# EAGLE design USB-C_Host_Shield (EAGLE 9.6.2)
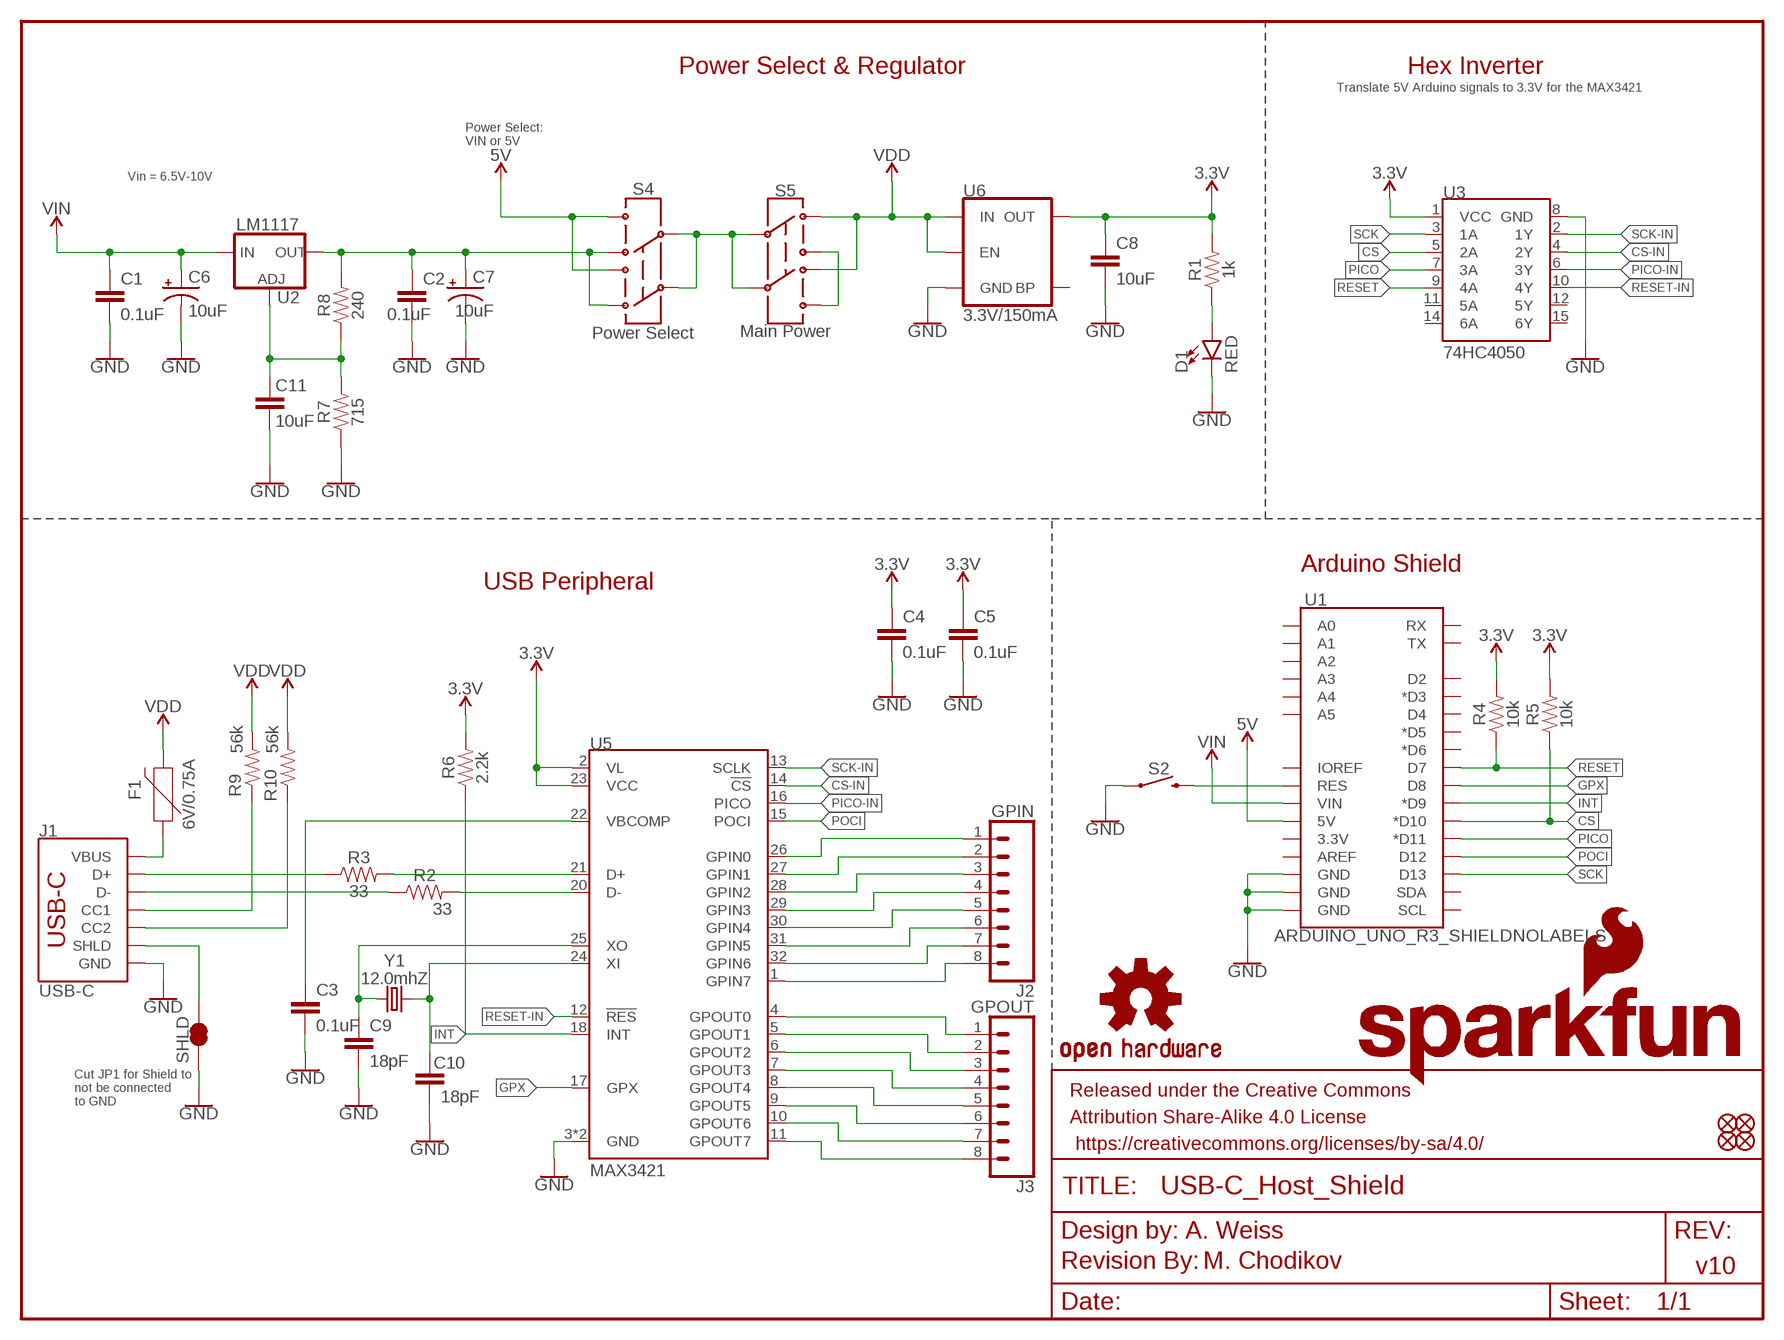
[diagram p0: schematic, sheet 1]

## Parts
C1  0.1uF  0.1UF-0603-25V-(+80/-20%)  [0603]
C2  0.1uF  0.1UF-0603-25V-(+80/-20%)  [0603]
C3  0.1uF  0.1UF-0603-25V-(+80/-20%)  [0603]
C4  0.1uF  0.1UF-0603-25V-(+80/-20%)  [0603]
C5  0.1uF  0.1UF-0603-25V-(+80/-20%)  [0603]
C6  10uF  10UF-POLAR-EIA3216-16V-10%(TANT)  [EIA3216]
C7  10uF  10UF-POLAR-EIA3216-16V-10%(TANT)  [EIA3216]
C8  10uF  10UF-0603-6.3V-20%  [0603]
C9  18pF  18PF-0603-50V-5%  [0603]
C10  18pF  18PF-0603-50V-5%  [0603]
C11  10uF  10UF-0805-25V-10%  [0805]
D1  RED  LED-RED0603  [LED-0603]
F1  6V/0.75A  PPTC_0.75A  [1206]
FD1  FIDUCIALUFIDUCIAL  [FIDUCIAL-MICRO]
FD2  FIDUCIALUFIDUCIAL  [FIDUCIAL-MICRO]
FD3  FIDUCIALUFIDUCIAL  [FIDUCIAL-MICRO]
FD4  FIDUCIALUFIDUCIAL  [FIDUCIAL-MICRO]
FRAME1  FRAME-LETTER  [CREATIVE_COMMONS]
J1  USB-C  USB_C_2-LAYER_PADS  [USB-C-16P-2LAYER-PADS]
J2  GPIN  CONN_08"  [1X08]
J3  GPOUT  CONN_08"  [1X08]
LOGO1  OSHW-LOGOM  [OSHW-LOGO-M]
LOGO2  SFE_LOGO_NAME_FLAME.1_INCH  [SFE_LOGO_NAME_FLAME_.1]
LOGO3  SFE_LOGO_NAME_FLAME.2_INCH  [SFE_LOGO_NAME_FLAME_.2]
LOGO7  REVISION  [REVISION]
R1  1k  1KOHM-0603-1/10W-1%  [0603]
R2  33  33OHM-0603-1/10W-1%  [0603]
R3  33  33OHM-0603-1/10W-1%  [0603]
R4  10k  10KOHM-0603-1/10W-1%  [0603]
R5  10k  10KOHM-0603-1/10W-1%  [0603]
R6  2.2k  2.2KOHM-0603-1/10W-1%  [0603]
R7  715  715OHM-0603-1/10W-1%  [0603]
R8  240  240OHM-0603-1/10W-1%  [0603]
R9  56k  56KOHM  [0603]
R10  56k  56KOHM  [0603]
S2  MOMENTARY-SWITCH-SPST-SMD-5.2MM-TALL  [TACTILE_SWITCH_SMD_5.2MM]
S4  Power Select  SWITCH-DPDT-SMD-AYZ0202  [SWITCH_DPDT_SMD_AYZ0202]
S5  Main Power  SWITCH-DPDT-SMD-AYZ0202  [SWITCH_DPDT_SMD_AYZ0202]
SHLD  JUMPER-SMT_2_NC_TRACE_SILK  [SMT-JUMPER_2_NC_TRACE_SILK]
U1  ARDUINO_UNO_R3_SHIELDNOLABELS  [UNO_R3_SHIELD_NOLABELS]
U2  LM1117  V_REG_LM1117SOT223  [SOT223]
U3  74HC4050  HEX_CONVERTER  [SO16]
U5  MAX3421  [TQFP32]
U6  3.3V/150mA  V_REG_MIC52053.3V  [SOT23-5]
Y1  12.0mhZ  CRYSTAL-12MHZ  [CRYSTAL-SMD-2X2.5MM]

## Nets
3.3V: C4.1 C5.1 C8.1 R1.2 R4.2 R5.2 R6.2 U3.1(VCC) U5.2(VL) U5.23(VCC) U6.5(OUT)
5V: S4.1 S4.4 U1.5V
CC1: J1.A5(CC1) R9.1
CC2: J1.B5(CC2) R10.1
CS: R5.1 U1.D10(*D10) U3.5(2A)
CS-IN: U3.4(2Y) U5.14(!CS)
D_N [diff pairs]: J1.A7(D-) J1.B7(D-) R2.1
D_P [diff pairs]: J1.A6(D+) J1.B6(D+) R3.1
GND: C1.2 C2.2 C3.2 C4.2 C5.2 C6.- C7.- C8.2 C9.2 C10.2 C11.2 D1.C J1.GND J1.GND2(GND) R7.1 S2.1 SHLD.1 U1.GND@0(GND) U1.GND@1(GND) U1.GND@2(GND) U3.8(GND) U5.3(GND) U5.19(GND) U6.2(GND)
GPIN0: J2.1 U5.26(GPIN0)
GPIN1: J2.2 U5.27(GPIN1)
GPIN2: J2.3 U5.28(GPIN2)
GPIN3: J2.4 U5.29(GPIN3)
GPIN4: J2.5 U5.30(GPIN4)
GPIN5: J2.6 U5.31(GPIN5)
GPIN6: J2.7 U5.32(GPIN6)
GPIN7: J2.8 U5.1(GPIN7)
GPOUT0: J3.1 U5.4(GPOUT0)
GPOUT1: J3.2 U5.5(GPOUT1)
GPOUT2: J3.3 U5.6(GPOUT2)
GPOUT3: J3.4 U5.7(GPOUT3)
GPOUT4: J3.5 U5.8(GPOUT4)
GPOUT5: J3.6 U5.9(GPOUT5)
GPOUT6: J3.7 U5.10(GPOUT6)
GPOUT7: J3.8 U5.11(GPOUT7)
GPX: U1.D8 U5.17(GPX)
INT: R6.1 U1.D9(*D9) U5.18(INT)
MAX_D_N: R2.2 U5.20(D-)
MAX_D_P: R3.2 U5.21(D+)
N$1: S2.3 U1.RES
N$2: S4.2 S4.5 S5.2 S5.5
N$4: C11.1 R7.2 R8.1 U2.1(ADJ)
N$5: S5.1 S5.4
N$6: C2.1 C7.+ R8.2 S4.3 S4.6 U2.2(OUT) U2.4(OUT)
N$7: D1.A R1.1
N$8: J1.SHLD1(SHLD) J1.SHLD2(SHLD) J1.SHLD3(SHLD) J1.SHLD4(SHLD) SHLD.2
PICO: U1.D11(*D11) U3.7(3A)
PICO-IN: U3.6(3Y) U5.16(PICO)
POCI: U1.D12 U5.15(POCI)
RESET: R4.1 U1.D7 U3.9(4A)
RESET-IN: U3.10(4Y) U5.12(!RES)
SCK: U1.D13 U3.3(1A)
SCK-IN: U3.2(1Y) U5.13(SCLK)
VBCOMP: C3.1 U5.22(VBCOMP)
VBUS: F1.1 J1.VBUS1(VBUS) J1.VBUS2(VBUS)
VDD: F1.2 R9.2 R10.2 S5.3 S5.6 U6.1(IN) U6.3(EN)
VIN: C1.1 C6.+ U1.VIN U2.3(IN)
XI: C10.1 U5.24(XI) Y1.P3
XO: C9.1 U5.25(XO) Y1.P1
Unconnected: U1.3.3V U1.A0 U1.A1 U1.A2 U1.A3 U1.A4 U1.A5 U1.AREF U1.D2 U1.D3(*D3) U1.D4 U1.D5(*D5) U1.D6(*D6) U1.IOREF U1.RX U1.SCL U1.SDA U1.TX U3.11(5A) U3.12(5Y) U3.14(6A) U3.15(6Y) U6.4(BP)

## Notes on the sheet
- Power Select & Regulator | Hex Inverter
- Translate 5V Arduino signals to 3.3V for the MAX3421
- Power Select:
  VIN or 5V
- Vin = 6.5V-10V
- Arduino Shield
- USB Peripheral
- Cut JP1 for Shield to
  not be connected
  to GND
- A. Weiss
- M. Chodikov | v10

## Library data of the parts
C1-C5 = SparkFun-Capacitors:0.1UF: 0.1µF ceramic capacitors A capacitor is a passive two-terminal electrical component used to store electrical energy temporarily in an electric field.; PROD_ID: CAP-00810
C6 C7 = SparkFun-Capacitors:10UF-POLAR: 10.0µF polarized capacitors A capacitor is a passive two-terminal electrical component used to store electrical energy temporarily in an electric field.; PROD_ID: CAP-00811
C8 = SparkFun-Capacitors:10UF: 10.0µF ceramic capacitors A capacitor is a passive two-terminal electrical component used to store electrical energy temporarily in an electric field.; PROD_ID: CAP-11015
C9 C10 = SparkFun-Capacitors:18PF: 18pF ceramic capacitors A capacitor is a passive two-terminal electrical component used to store electrical energy temporarily in an electric field.; PROD_ID: CAP-08267
C11 = SparkFun-Capacitors:10UF: 10.0µF ceramic capacitors A capacitor is a passive two-terminal electrical component used to store electrical energy temporarily in an electric field.; PROD_ID: CAP-14259
D1 = SparkFun-LED:LED-RED: Red SMD LED Used in manufacturing of most products at SparkFun Packages: 0603 - SMD 0603 package [Product Link] <http://docs.avagotech.com/docs/AV02-0551EN> 0603 SMART - SMD 0603 SMART package ( more efficient and expensive)[Product Link] <http://www.osram-os.com/Graphics/XPic2/00077099_0.pdf> 1206 - SMD1206 package [Product Link] <https://www.sparkfun.com/datasheets/DevTools/LilyPad/Q150OVS4.pdff> SparkFun Products: Pro Mini 328 -5V <https://www.sparkfun.com/products/821> RedBoard <https://www.sparkfun.com/products/12757> IOIO-OTG <https://www.sparkfun.com/products/13613>; PROD_ID: DIO-00819
F1 = SparkFun-Fuses:PPTC: Resettable Fuse PPTC Resettable Fuse. Really a sort of resistor with a polymeric positive temperature coefficient whose resistance increases dramatically with an increase in temperature. When heated by the power passing through the resistance rises causing the current to be limited, protecting the circuit. This is achieved by the transition of the polymer from a crystalline to an amorphous state where the conductive carbon separates breaking the conductive pathways found in the cool crystalline structure. When a PPTC cools back down it resumes conducting letting the circuit turn back on. SparkFun Products: SparkFun RedBoard - Programmed with Arduino <https://www.sparkfun.com/products/12757> Pro Micro - 5V/16MHz <https://www.sparkfun.com/products/12640> Arduino Pro 328 - 5V/16MHz <https://www.sparkfun.com/products/10915> MP3 Trigger <https://www.sparkfun.com/products/13720>; PROD_ID: RES-11150
FD1-FD4 = SparkFun-Aesthetics:FIDUCIAL: Fiducial Alignment Points Point-of-reference for pick-and-place machines and other optical instruments.
FRAME1 = SparkFun-Aesthetics:FRAME-LETTER: Schematic Frame - Letter Standard 8.5x11 US Letter frame
J1 = SparkFun-Connectors:USB_C: USB Type C 16Pin Connector Super Speed pins not available on the 16-pin purely SMD connector so this part is best for USB 2.0 implementations. D1 and D2 are tied together enabling D+/- no matter which way the cable is plugged into the connector. The two channel configuration pins (CC1/2) are exposed. These are normally connected to ground via 5.1k resistors but can be reconfigured for high current/high power applications. **4-LAYER BOARD WARNING!!** If designing 4-layer board, make sure to select the variant _4-LAYER-ISOLATED. The linked footprint (USB-C-16-4LAYER-ISOLATED) includes some very necessary cutout polygons in the inner layers (2 and 15). This prevents the PTH mounting shield legs on the USB connector from electrically connecting any other polygons on the inner layers (usually VCC and GND).; PROD_ID: CONN-14122
J2 J3 = SparkFun-Connectors:CONN_08: Multi connection point. Often used as Generic Header-pin footprint for 0.1 inch spaced/style header connections On any of the 0.1 inch spaced packages, you can populate with these: Break Away Headers - Straight <https://www.sparkfun.com/products/116> (PRT-00116) Break Away Male Headers - Right Angle <https://www.sparkfun.com/products/553> (PRT-00553) Female Headers <https://www.sparkfun.com/products/115> (PRT-00115) Break Away Headers - Machine Pin <https://www.sparkfun.com/products/117> (PRT-00117) Break Away Female Headers - Swiss Machine Pin <https://www.sparkfun.com/products/743> (PRT-00743) Arduino Stackable Header - 8 Pin <https://www.sparkfun.com/products/9279> (PRT-09279) For SCREWTERMINALS and SPRING TERMINALS visit here: Screw Terimnals on SparkFun.com <https://www.sparkfun.com/search/results?term=Screw+Terminals> (5mm/3.5mm/2.54mm spacing) This device is also useful as a general connection point to wire up your design to another part of your project. Our various solder wires solder well into these plated through hole pads. Hook-Up Wire - Assortment (Stranded, 22 AWG) <https://www.sparkfun.com/products/11375> (PRT-11375) Hook-Up Wire - Assortment (Solid Core, 22 AWG) <https://www.sparkfun.com/products/11367> (PRT-11367) View the entire wire category on our website here <https://www.sparkfun.com/categories/141> Special notes: Molex polarized connector foot print use with SKU : PRT-08231 with associated crimp pins and housings. 1MM SMD Version SKU: PRT-10208 NOTES ON THE VARIANTS LOCK and LOCK_LONGPADS... This footprint was designed to help hold the alignment of a through-hole component (i.e. 6-pin header) while soldering it into place. You may notice that each hole has been shifted either up or down by 0.005 of an inch from it's more standard position (which is a perfectly straight line). This slight alteration caused the pins (the squares in the middle) to touch the edges of the holes. Because they are alternating, it causes a "brace" to hold the component in place. 0.005 has proven to be the perfect amount of "off-center" position when using our standard breakaway headers. Although looks a little odd when you look at the bare footprint, once you have a header in there, the alteration is very hard to notice. Also,if you push a header all the way into place, it is covered up entirely on the bottom side.; PROD_ID: CONN-08438
LOGO1 = SparkFun-Aesthetics:OSHW-LOGO: Open-Source Hardware (OSHW) Logo This logo indicates the piece of hardware it is found on incorporates a OSHW license and/or adheres to the definition of open source hardware found here: http://freedomdefined.org/OSHW
LOGO2 LOGO3 = SparkFun-Aesthetics:SFE_LOGO_NAME_FLAME: SparkFun Font Logo w/ Flame This is the SparkFun full logo. The logo on the schematic will always be the same size; the package variant is the height of the flame part of the logo. Default layer for the logo on the board is tSilk.
LOGO7 = SparkFun-Aesthetics:REVISION: "Revision By" Text Preceding text for revisor documentation. Includes schematic text on "symbols" layer, and board text on tDoc.
R1 = SparkFun-Resistors:1KOHM: 1kΩ resistor A resistor is a passive two-terminal electrical component that implements electrical resistance as a circuit element. Resistors act to reduce current flow, and, at the same time, act to lower voltage levels within circuits. - Wikipedia; PROD_ID: RES-07856
R2 R3 = SparkFun-Resistors:33OHM: 33Ω resistor A resistor is a passive two-terminal electrical component that implements electrical resistance as a circuit element. Resistors act to reduce current flow, and, at the same time, act to lower voltage levels within circuits. - Wikipedia; PROD_ID: RES-08270
R4 R5 = SparkFun-Resistors:10KOHM: 10kΩ resistor A resistor is a passive two-terminal electrical component that implements electrical resistance as a circuit element. Resistors act to reduce current flow, and, at the same time, act to lower voltage levels within circuits. - Wikipedia; PROD_ID: RES-00824
R6 = SparkFun-Resistors:2.2KOHM: 2.2kΩ resistor A resistor is a passive two-terminal electrical component that implements electrical resistance as a circuit element. Resistors act to reduce current flow, and, at the same time, act to lower voltage levels within circuits. - Wikipedia; PROD_ID: RES-08272
R7 = SparkFun-Resistors:715OHM: 715Ω resistor A resistor is a passive two-terminal electrical component that implements electrical resistance as a circuit element. Resistors act to reduce current flow, and, at the same time, act to lower voltage levels within circuits. - Wikipedia; PROD_ID: RES-07850
R8 = SparkFun-Resistors:240OHM: 240Ω resistor A resistor is a passive two-terminal electrical component that implements electrical resistance as a circuit element. Resistors act to reduce current flow, and, at the same time, act to lower voltage levels within circuits. - Wikipedia; PROD_ID: RES-07849
R9 R10 = SparkFun-Resistors:56KOHM: 56kΩ Resistor; PROD_ID: RES-17211
S2 = SparkFun-Switches:MOMENTARY-SWITCH-SPST: Momentary Switch (Pushbutton) - SPST Normally-open (NO) SPST momentary switches (buttons, pushbuttons). Variants PTH-12MM - 12mm square, through-hole Momentary Pushbutton Switch - 12mm Square <https://www.sparkfun.com/products/9190> (COM-09190) PTH-6.0MM, PTH-6.0MM-KIT - 6.0mm square, through-hole Mini Pushbutton Switch <https://www.sparkfun.com/products/97> (COM-00097) KIT package intended for soldering kit's - only one side of pads' copper is exposed. PTH-RIGHT-ANGLE-KIT - Right-angle, through-hole Right Angle Tactile Button <https://www.sparkfun.com/products/10791> - Used on SparkFun BigTime Watch Kit <https://www.sparkfun.com/products/11734> SMD-12MM - 12mm square, surface-mount Tactile Button - SMD (12mm) <https://www.sparkfun.com/products/12993> (COM-12993) Used on SparkFun PicoBoard <https://www.sparkfun.com/products/11888> SMD-4.5MM - 4.5mm Square Trackball Switch Used on SparkFun Blackberry Trackballer Breakout <https://www.sparkfun.com/products/13169> SMD-4.6MMX2.8MM - 4.60mm x 2.80mm, surface mount Used on SparkFun Pro Micro - RP2040 <https://www.sparkfun.com/products/17717> SMD-5.2MM, SMD-5.2-REDUNDANT - 5.2mm square, surface-mount Mini Pushbutton Switch - SMD <https://www.sparkfun.com/products/8720> (COM-08720) Used on Arduino Pro Mini <https://www.sparkfun.com/products/11114> REDUNDANT package connects both switch circuits together SMD-6.0X3.5MM - 6.0 x 3.5mm, surface mount Momentary Reset Switch SMD <https://www.sparkfun.com/products/8229> (COM-08229) SMD-6.2MM-TALL - 6.2mm square, surface mount Tactile Button - SMD (6mm) <https://www.sparkfun.com/products/12992> Used on SparkFun Digital Sandbox <https://www.sparkfun.com/products/12651> SMD-RIGHT-ANGLE - Right-angle, surface mount Used on SparkFun Block for Intel® Edison - Arduino <https://www.sparkfun.com/products/13036>; PROD_ID: SWCH-14139
S4 S5 = SparkFun-Switches:SWITCH-DPDT: Double-Pole, Double-Throw (DPDT) Switch Double-pole, double-throw switches. Variant Overview PTH-GPI-152-3013 Used on SparkFun Geiger Counter <https://www.sparkfun.com/products/11345> SMD-AY0202 Surface Mount DPDT Switch <https://www.sparkfun.com/products/597> (COM-00597) Used on e.g. LilyPad Arduino USB - ATmega32U4 Board <https://www.sparkfun.com/products/12049>; PROD_ID: SWCH-08179; SF_SKU: COM-00597
SHLD = SparkFun-Jumpers:JUMPER-SMT_2_NC_TRACE: Normally closed trace jumper This jumper has a trace between two pads so it's normally closed (NC). Use a razor knife to open the connection. For best results follow the IPC guidelines for cutting traces: Cutout at least 0.063 mm (0.005 in). Remove all loose material to clean up the cut area. Seal the cut with an approved epoxy. Reapply solder to reclose the connection.
U1 = SparkFun-Boards:ARDUINO_UNO_R3_SHIELD: Arduino R3 Shield Footprint Shield form compatible with the Arduino Uno R3. SparkFun Products: MG2639 Cellular Shield <https://www.sparkfun.com/products/13120> MIDI Shield <https://www.sparkfun.com/products/12898> R3 Stackable Headers Kit <https://www.sparkfun.com/products/11417>
U2 = SparkFun-IC-Power:V_REG_LM1117: Voltage Regulator LM1117 Standard adjustable voltage regulator but in SMD form. Spark Fun Electronics SKU : COM-00595; PROD_ID: VREG-08170
U3 = SparkFun-IC-Comms:HEX_CONVERTER: 74HC4050 Hex Buffer 74HC4050 Hex Buffer Level Shifter SMD SO016 SparkFun Products CAN-BUS Shield <https://www.sparkfun.com/products/13262> (DEV-13262) SparkFun MP3 Player Shield <https://www.sparkfun.com/products/12660> (DEV-12660) SparkFun microSD Shield <https://www.sparkfun.com/products/12761> (DEV-12761) SparkFun USB Host Shield <https://www.sparkfun.com/products/9947> (DEV-09947); PROD_ID: IC-09604
U5 = SparkFun-IC-Microcontroller:MAX3421: USB Peripheral/Host Controller with SPI Interface; PROD_ID: IC-09517
U6 = SparkFun-IC-Power:V_REG_MIC5205: V_REG MIC5205 Standard 3.3V, 5V, and Adjustable 150mA LDO voltage regulator in SOT-23 layout. Micrel part MIC5205. BP (by-pass) pin is used to lower output noise with 470pF cap, may be left open. On the adjustable version BP is used to set output.; PROD_ID: VREG-00822
Y1 = SparkFun-Clocks:CRYSTAL-12MHZ: 12.0MHz Crystal Frequency: 12.0MHz Frequency Tolerance: ±20ppm Load Capacitance: 18pF SparkFun Products: SparkFun Logomatic <https://www.sparkfun.com/products/12772> Pocket AVR Programmer <https://www.sparkfun.com/products/9825>; PROD_ID: XTAL-15540

## Net classes
2 diff pairs: width 0.089 mm

## Board
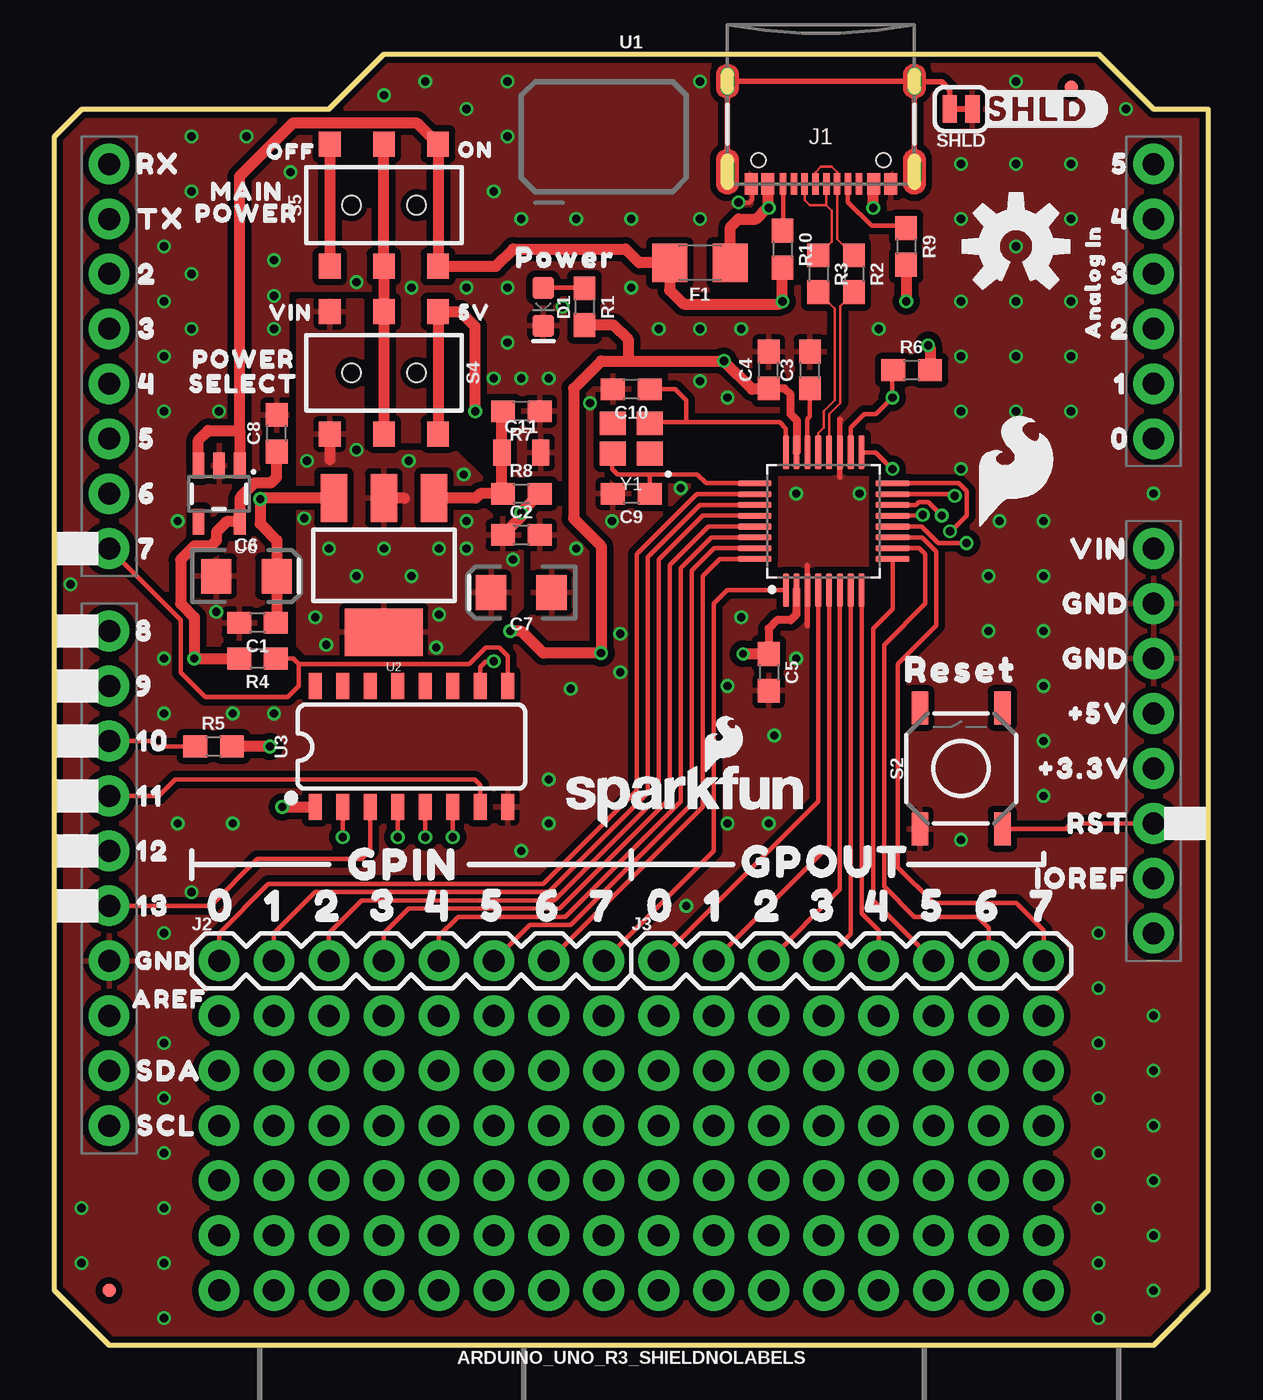
[diagram p1: board, top side]
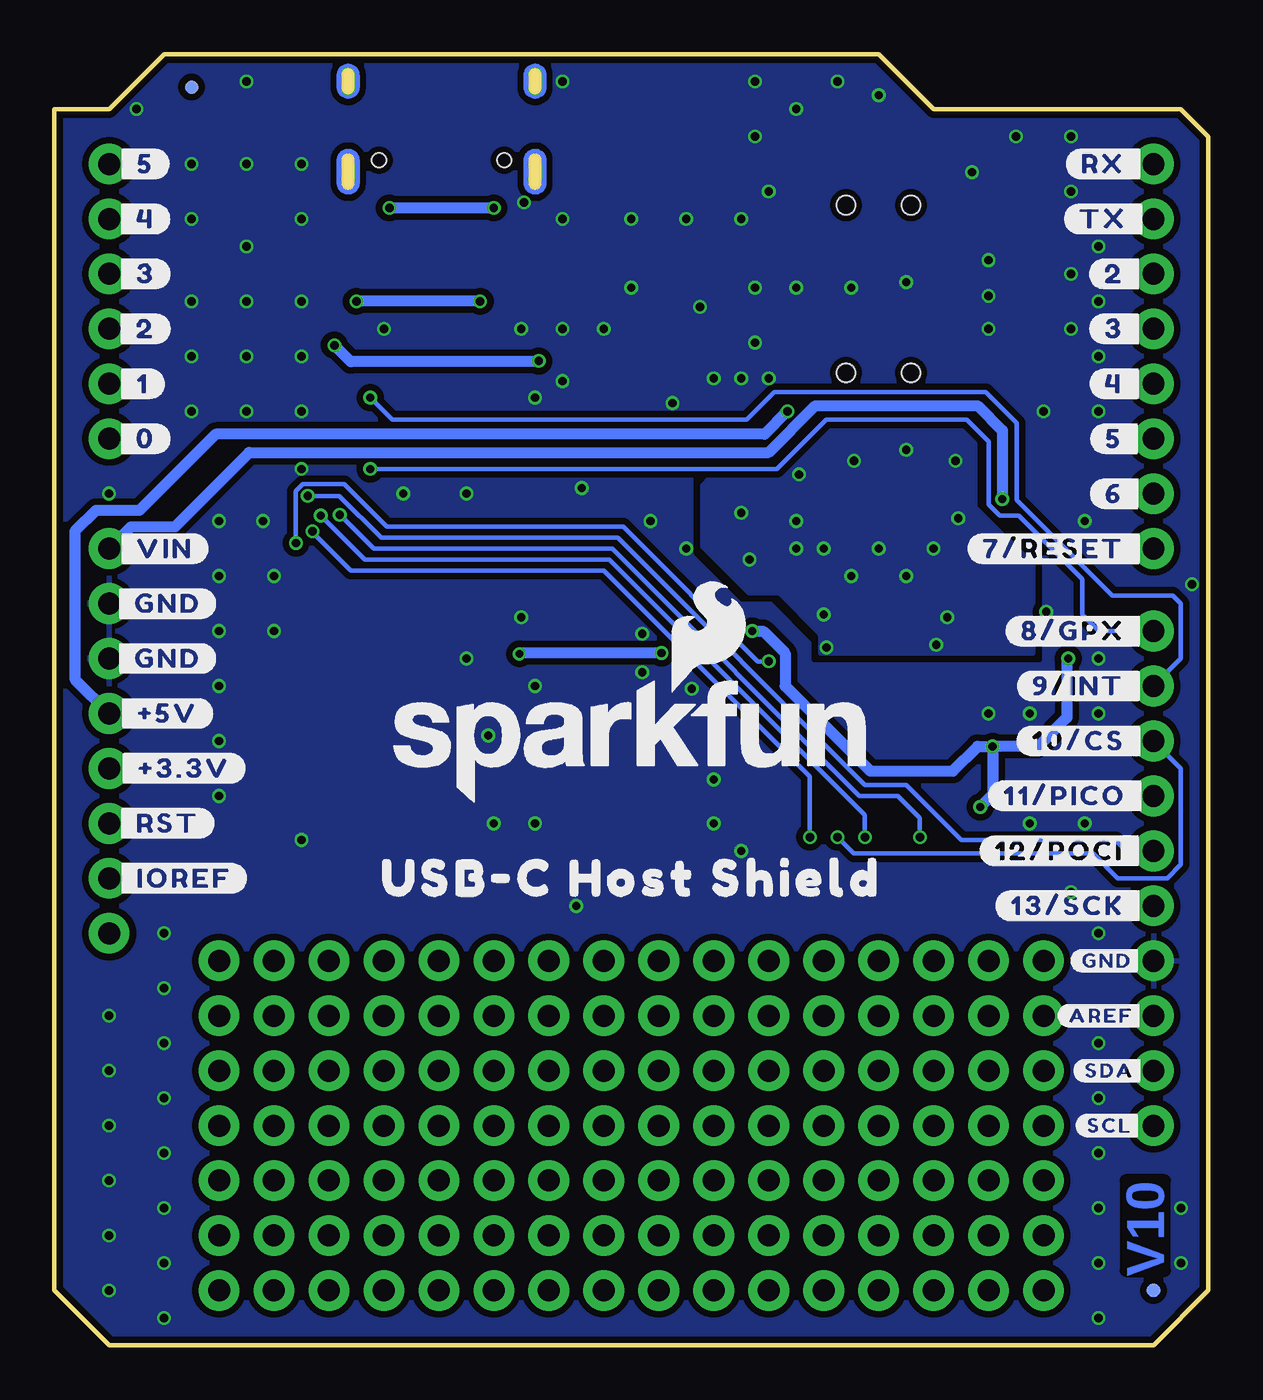
[diagram p2: board, bottom side, seen from below]

Size 53.34 x 59.69 mm. Coordinates in mm from the lower left corner, seen from the top.
Outline: 2.54,0 50.8,0 53.34,2.54 53.34,57.15 50.8,57.15 48.26,59.69 15.24,59.69 12.7,57.15 1.27,57.15 0,55.88 0,2.54 2.54,0
Copper layers (1*16): Top 0.035mm / dielectric 1.5mm / Bottom 0.035mm
Design rules "SparkFun-2-Layer-Minimum-JLCPCB *": minimum track width 5mil, minimum drill 0.3mm, track to track 5mil, track to pad 5mil, pad to pad 5mil, via to via 5mil, smd to smd 5mil, copper to edge 7mil, drill to drill 7mil, minimum pad ring 5mil, minimum via ring 5mil, stop-mask expansion 2.5mil, vias tented up to drill 25mil, thermal gap 10mil

### Footprints (pad centres in the part's own frame; a part is rotated, then mirrored left to right if it is on the bottom)
0603 = smd 1.1 x 1: 1 -0.85,0; 2 0.85,0
EIA3216 = smd 1.4 x 1.6: + 1.4,0; - -1.4,0
0805 = smd 0.8 x 1.2: 1 -0.9,0; 2 0.9,0
LED-0603 = smd 1 x 1: A -0.877,0; C 0.877,0
1206 = smd 1.6 x 1.8: 1 -1.4,0; 2 1.4,0
FIDUCIAL-MICRO = smd 0.635 x 0.635: 1 0,0
USB-C-16P-2LAYER-PADS = smd 0.3 x 1: A5 -1.25,-0.34; A6 -0.25,-0.34; A7 0.25,-0.34; A8 1.25,-0.34; B5 1.75,-0.34; B6 0.75,-0.34; B7 -0.75,-0.34; B8 -1.75,-0.34 | smd 0.6 x 1: GND -3.225,-0.34; GND2 3.225,-0.34; VBUS1 -2.45,-0.34; VBUS2 2.45,-0.34 | drill 0.4 pad 0.6 long: SHLD1 -4.318,-0.915; SHLD2 4.318,-0.915; SHLD3 -4.318,-5.095; SHLD4 4.318,-5.095 | hole 0.65: -2.89,-1.445; 2.89,-1.445
1X08 = drill 1.016 pad 1.88: 1 0,0; 2 2.54,0; 3 5.08,0; 4 7.62,0; 5 10.16,0; 6 12.7,0; 7 15.24,0; 8 17.78,0
TACTILE_SWITCH_SMD_5.2MM = smd 1.524 x 0.762: 1 -2.794,1.905; 2 2.794,1.905; 3 -2.794,-1.905; 4 2.794,-1.905
SWITCH_DPDT_SMD_AYZ0202 = smd 1 x 1.15: 1 -2.5,2.825; 2 0,2.825; 3 2.5,2.825; 4 -2.5,-2.825; 5 0,-2.825; 6 2.5,-2.825 | hole 0.85: 1.5,0; -1.5,0
SMT-JUMPER_2_NC_TRACE_SILK = smd 0.66 x 1.27: 1 -0.521,0; 2 0.521,0
UNO_R3_SHIELD_NOLABELS = drill 1.016 pad 1.88: 3.3V 24.13,-3.81; 5V 24.13,-1.27; A0 24.13,11.43; A1 24.13,13.97; A2 24.13,16.51; A3 24.13,19.05; A4 24.13,21.59; A5 24.13,24.13; AREF -24.13,-15.24; D2 -24.13,19.05; D3 -24.13,16.51; D4 -24.13,13.97; D5 -24.13,11.43; D6 -24.13,8.89; D7 -24.13,6.35; D8 -24.13,2.54; D9 -24.13,0; D10 -24.13,-2.54; D11 -24.13,-5.08; D12 -24.13,-7.62; D13 -24.13,-10.16; GND@0 24.13,1.27; GND@1 24.13,3.81; GND@2 -24.13,-12.7; IOREF 24.13,-8.89; NC 24.13,-11.43; RES 24.13,-6.35; RX -24.13,24.13; SCL -24.13,-20.32; SDA -24.13,-17.78; TX -24.13,21.59; VIN 24.13,6.35
SOT223 = smd 1.219 x 2.235: 1 -2.311,-3.099; 2 0,-3.099; 3 2.311,-3.099 | smd 3.6 x 2.2: 4 0,3.099
SO16 = smd 0.6 x 1.2: 1 -4.445,-2.8; 2 -3.175,-2.8; 3 -1.905,-2.8; 4 -0.635,-2.8; 5 0.635,-2.8; 6 1.905,-2.8; 7 3.175,-2.8; 8 4.445,-2.8; 9 4.445,2.8; 10 3.175,2.8; 11 1.905,2.8; 12 0.635,2.8; 13 -0.635,2.8; 14 -1.905,2.8; 15 -3.175,2.8; 16 -4.445,2.8
TQFP32 = smd 1.56 x 0.28: 1 -3.18,1.75; 2 -3.18,1.25; 3 -3.18,0.75; 4 -3.18,0.25; 5 -3.18,-0.25; 6 -3.18,-0.75; 7 -3.18,-1.25; 8 -3.18,-1.75; 17 3.18,-1.75; 18 3.18,-1.25; 19 3.18,-0.75; 20 3.18,-0.25; 21 3.18,0.25; 22 3.18,0.75; 23 3.18,1.25; 24 3.18,1.75 | smd 0.28 x 1.56: 9 -1.75,-3.18; 10 -1.25,-3.18; 11 -0.75,-3.18; 12 -0.25,-3.18; 13 0.25,-3.18; 14 0.75,-3.18; 15 1.25,-3.18; 16 1.75,-3.18; 25 1.75,3.18; 26 1.25,3.18; 27 0.75,3.18; 28 0.25,3.18; 29 -0.25,3.18; 30 -0.75,3.18; 31 -1.25,3.18; 32 -1.75,3.18
SOT23-5 = smd 0.55 x 1.2: 1 -0.95,-1.3; 2 0,-1.3; 3 0.95,-1.3; 4 0.95,1.3; 5 -0.95,1.3
CRYSTAL-SMD-2X2.5MM = smd 1.2 x 1.1: P1 0.846,0.69; P2 -0.854,0.69; P3 -0.854,-0.71; P4 0.846,-0.71

### Placement (x,y rotation side)
C1  9.4,33.4 180 top
C2  21.59,37.46 0 top
C3  34.92,45.09 90 top
C4  33.02,45.09 90 top
C5  33.02,31.11 270 top
C6  8.89,35.56 0 top
C7  21.59,34.8 180 top
C8  10.29,42.16 90 top
C9  26.67,39.37 180 top
C10  26.67,44.2 180 top
C11  21.59,41.27 0 top
D1  22.61,48.01 270 top
F1  29.84,50.04 180 top
FD1  2.54,2.54 0 bottom
FD2  2.54,2.54 90 top
FD3  46.99,58.17 0 bottom
FD4  46.99,58.17 0 top
FRAME1  1.27,-30.48 0 top  (outside the outline)
J1  35.43,53.34 180 top
J2  7.62,17.78 0 top
J3  27.94,17.78 0 top
LOGO1  44.45,50.8 0 top
LOGO2  29.21,25.4 0 top
LOGO3  26.67,27.94 0 bottom
LOGO7  12.7,-33.02 0 top  (outside the outline)
R1  24.51,48.01 270 top
R2  36.96,49.53 270 top
R3  35.31,49.53 270 top
R4  9.4,31.75 180 top
R5  7.37,27.69 0 top
R6  39.62,45.09 0 top
R7  21.59,43.18 180 top
R8  21.59,39.37 0 top
R9  39.37,50.8 270 top
R10  33.66,50.67 270 top
S2  41.91,26.67 90 top
S4  15.24,44.96 180 top
S5  15.24,52.7 0 top
SHLD  41.91,57.15 180 top
U1  26.67,30.48 0 top
U2  15.24,36.07 180 top
U3  16.51,27.69 0 top
U5  35.56,38.1 90 top
U6  7.62,39.37 180 top
U$1  [5V6]  19.43,47.75 0 top
U$2  [POWER23]  23.62,50.29 0 top
U$3  [GPIN42]  16.13,22.22 0 top
U$4  [SFE_LOGO_FLAME_.2]  44.45,40.39 0 top
U$5  [ON26]  19.47,55.27 0 top
U$6  [RESET25]  41.91,31.24 0 top
U$7  [OFF27]  10.94,55.18 0 top
U$8  [ANALOG_IN28]  48.01,49.15 90 top
U$9  [USB#C_HOST_SHIELD32]  26.67,21.59 0 bottom
U$10  [POWER11]  8.76,45.59 0 top
U$11  [SHLD#33]  45.47,57.15 0 top
U$12  [VIN7]  10.92,47.75 0 top
U$13  [SELECT12]  8.76,44.45 0 top
U$14  [POWER38]  8.89,52.32 0 top
U$15  [MAIN40]  8.89,53.34 0 top
U$16  [GPOUT44]  35.69,22.35 0 top
U$17  [045]  28.07,20.32 0 top
U$18  [146]  30.48,20.32 0 top
U$19  [2147]  33.02,20.32 0 top
U$20  [32148]  35.56,20.32 0 top
U$21  [4332150]  38.1,20.32 0 top
U$22  [4332150]  17.78,20.32 0 top
U$23  [54332151]  20.32,20.32 0 top
U$24  [654332152]  43.18,20.32 0 top
U$25  [54332151]  40.64,20.32 0 top
U$26  [654332152]  22.86,20.32 0 top
U$27  [7654332153]  45.72,20.32 0 top
U$28  [7654332153]  25.4,20.32 0 top
U$29  [045]  7.75,20.32 0 top
U$30  [146]  10.16,20.32 0 top
U$31  [2147]  12.7,20.32 0 top
U$32  [32148]  15.24,20.32 0 top
U$33  [#5V4]  48.26,29.21 0 top
U$34  [VIN6]  48.26,36.83 0 top
U$35  [GND131211109817654321131211211109876543260]  48.13,31.75 0 top
U$36  [SDA131211109817654321131211211109876543261]  5.33,12.7 0 top
U$37  [GND131211211109876543229]  5.08,17.78 0 top
U$38  [21131211211109876543246]  4.32,49.53 0 top
U$39  [321131211211109876543247]  4.32,46.99 0 top
U$40  [4321131211211109876543248]  4.32,44.45 0 top
U$41  [54321131211211109876543249]  4.32,41.91 0 top
U$42  [654321131211211109876543250]  4.32,39.37 0 top
U$43  [7654321131211211109876543251]  4.32,36.83 0 top
U$44  [17654321131211211109876543252]  49.28,44.45 0 top
U$45  [017654321131211211109876543253]  49.28,41.91 0 top
U$46  [9817654321131211211109876543255]  4.19,30.48 0 top
U$47  [109817654321131211211109876543256]  4.57,27.94 0 top
U$48  [11109817654321131211211109876543257]  4.45,25.4 0 top
U$49  [1211109817654321131211211109876543258]  4.57,22.86 0 top
U$50  [131211109817654321131211211109876543259]  4.57,20.32 0 top
U$51  [GND131211109817654321131211211109876543260]  48.13,34.29 0 top
U$52  [AREF131211211109876543230]  5.33,16 0 top
U$53  [SCL131211109817654321131211211109876543262]  5.21,10.16 0 top
U$54  [IOREF131211109817654321131211211109876543264]  47.5,21.59 0 top
U$55  [21131211211109876543246]  49.28,46.99 0 top
U$56  [321131211211109876543247]  49.28,49.53 0 top
U$57  [4321131211211109876543248]  49.28,52.07 0 top
U$58  [54321131211211109876543249]  49.28,54.61 0 top
U$59  [817654321131211211109876543254]  4.19,33.02 0 top
U$60  [RST131211109817654321131211211109876543265]  48.26,24.13 0 top
U$61  [#_4#6]  49.28,52.07 0 bottom
U$62  [#3#3V4]  47.62,26.67 0 top
U$63  [#_5#6]  49.28,54.61 0 bottom
U$64  [RX13]  4.83,54.61 0 top
U$65  [TX1131211211109876543245]  4.95,52.07 0 top
U$66  [#_3#6]  49.28,49.53 0 bottom
U$67  [#_2#6]  49.28,46.99 0 bottom
U$68  [#_1#6]  49.4,44.45 0 bottom
U$69  [#_0#6]  49.28,41.91 0 bottom
U$70  [#_VIN#6]  48.39,36.83 0 bottom
U$71  [#_GND#7]  48.26,34.29 0 bottom
U$72  [#_GND#7]  48.26,31.75 0 bottom
U$73  [#_#5V#8]  48.26,29.21 0 bottom
U$74  [#_#3#3V#8]  47.5,26.67 0 bottom
U$75  [#_RST#8]  48.26,24.13 0 bottom
U$76  [#_IOREF#9]  47.5,21.59 0 bottom
U$77  [#RX_#10]  4.7,54.61 0 bottom
U$78  [#TX_#11]  4.7,52.07 0 bottom
U$79  [#2_#12]  4.19,49.53 0 bottom
U$80  [#3_#12]  4.19,46.99 0 bottom
U$81  [#4_#12]  4.19,44.45 0 bottom
U$82  [#5_#12]  4.19,41.91 0 bottom
U$83  [#6_#12]  4.19,39.37 0 bottom
U$84  [#7#RESET_#12]  6.99,36.83 0 bottom
U$85  [#8#GPX_#12]  6.1,33.02 0 bottom
U$86  [#9#INT_#12]  5.84,30.48 0 bottom
U$87  [#10#CS_#12]  5.84,27.94 0 bottom
U$88  [#11#PICO_#12]  6.48,25.4 0 bottom
U$89  [#12#POCI_#12]  6.73,22.86 0 bottom
U$90  [#13#SCK_#13]  6.35,20.32 0 bottom
U$92  [#GND#21]  4.7,17.78 0 bottom
U$93  [#SDA#18]  4.57,12.7 0 bottom
U$94  [#SCL#19]  4.57,10.16 0 bottom
U$95  [#AREF#20]  4.95,15.24 0 bottom
Y1  26.67,41.91 180 top

### Tracks (layer width: path | path; a pad name or v marks a point on that pad's centre or on a via)
3.3V  (via drill 0.35, 0.38)
  Top 0.381: 33.06,44.23 33.74,44.23 34.04,43.94 34.04,43.05 34.31,42.78 U5.23 | C5.1 33.02,33.15 33.4,33.53 34.04,33.53 34.31,33.8 U5.2
  Top 0.508: 26.67,45.51 25.27,45.51 24,44.23 24,38.23 25.27,36.96 v25.27,32 22.61,32 21.59,33.02 v21.08,33.02 | 26.67,45.51 v30.95,45.51 32.26,44.2 33.02,44.2 33.06,44.23 C4.1 | 26.67,45.51 26.54,45.63 26.54,46.48 25.87,47.16 R1.2 | v10.54,24.89 v10.55,24.89 U3.1 | C5.1 v31.84,31.96 | v40.39,46.23 40.47,46.14 R6.2 | C8.1 10.29,40.13 10.03,39.88 9.27,39.88 8.61,39.21 8.61,38.11 U6.5 7.97,38.07 7.49,37.59 7.49,37.21 7.24,36.96 6.48,36.96 5.84,36.32 5.84,34.29 6.48,33.66 v6.48,31.75 R4.2 | v9.97,27.69 R5.2
  Bottom 0.508: v25.27,32 31.8,32 v31.84,31.96 | v10.54,24.89 9.97,25.46 v9.97,27.69 | v30.95,45.51 30.99,45.47 39.62,45.47 v40.39,46.23 | v21.08,33.02 20.57,33.02 19.56,32 19.56,30.48 15.62,26.54 11.81,26.54 10.67,27.69 v9.97,27.69 | v9.97,27.69 7.87,27.69 6.55,29.01 6.55,31.68 v6.48,31.75
5V  (via drill 0.38)
  Top 0.508: v19.46,43.18 19.46,47.09 18.77,47.78 S4.4 S4.1
  Bottom 0.508: v19.46,43.18 20.51,42.12 45.88,42.12 49.4,38.6 51.41,38.6 52.38,37.63 52.38,30.79 U1.5V
CC1
  Top 0.203: J1.A5 36.68,52.85 37.78,51.75 39.27,51.75 R9.1
CC2
  Top 0.203: J1.B5 33.68,51.55 R10.1
CS  (via drill 0.38)
  Top 0.203: U3.5 v17.14,23.49 | U1.D10 4.45,27.94 4.7,27.69 R5.1
  Bottom 0.203: v17.14,23.49 16.38,22.73 5.33,22.73 4.19,21.59 1.91,21.59 1.27,22.22 1.27,26.67 U1.D10
CS-IN  (via drill 0.38)
  Top 0.203: U3.4 v15.88,23.49 | v41.02,38.35 40.39,38.99 39.96,38.99 39.82,38.85 U5.14
  Bottom 0.203: v15.88,23.49 15.88,24.51 27.69,36.32 38.99,36.32 v41.02,38.35
D_N
  Top 0.127: J1.A7 35.18,54.23 35.43,54.48 35.94,54.48 36.18,54.24 J1.B7 36.18,52.56 36.2,52.55 36.2,51.14 R2.1
D_P
  Top 0.127: J1.B6 34.68,52.95 34.92,52.7 35.68,52.7 | J1.A6 35.68,52.7 | R3.1 35.94,51.02 35.94,52.45 35.68,52.7
GND  (via drill 0.38)
  Top 0.203: v31.62,52.83 32.13,52.83 32.26,52.96 32.26,53.63 J1.GND2
  Top 0.254: 36.32,42.8 36.31,42.79 U5.19 36.31,40.14 | 34.81,36.06 U5.3 34.81,33.29
  other vias: 6.35,20.95 5.08,1.27 5.08,6.35 5.08,3.81 46.99,54.61 44.45,54.61 46.99,52.07 44.45,50.8 17.14,58.42 50.8,15.24 50.8,12.7 50.8,10.16 50.8,5.08 22.86,44.7 31.11,43.81 41.91,54.61 15.24,57.78 5.08,8.89 5.08,11.43 50.8,7.62 48.26,6.35 48.26,8.89 48.26,11.43 48.26,13.97 48.26,16.51 50.8,39.37 48.26,3.81 50.8,2.54 5.08,13.97 19.05,57.15 45.72,27.94 5.08,31.75 24.13,52.07 26.67,52.07 27.94,46.99 31.75,46.99 29.84,46.99 34.29,39.37 37.21,39.37 24.13,36.83 23.88,30.35 22.86,26.16 22.86,24.13 21.59,22.86 8.26,24.13 5.71,24.13 5.08,29.21 5.08,45.72 5.08,43.18 6.35,53.34 6.35,55.88 8.89,55.88 41.91,48.26 44.45,48.26 46.99,48.26 41.91,45.72 44.45,45.72 46.99,45.72 41.91,43.18 44.45,43.18 46.99,43.18 45.72,38.1 45.72,35.56 43.18,35.56 45.72,33.02 43.18,33.02 45.72,30.48 20.95,58.42 5.08,50.8 5.71,38.1 10.16,46.99 5.08,48.26 10.16,48.51 21.59,52.07 20.95,48.89 23.5,48.01 21.59,44.7 25.78,38.1 31.11,30.48 31.75,33.66 33.02,24.13 31.11,24.13 29.21,20.32 48.26,19.05 45.72,25.4 41.91,23.37 8.26,29.21 29.84,58.42 29.84,52.07 20.95,55.88 43.69,38.1 6.35,49.53 33.27,28.19 41.91,52.07 6.35,46.99 28.96,39.62 24.77,43.56 5.08,19.05 38.1,46.99 20.32,53.34 26.67,48.89 26.16,31.11 44.45,58.42 49.53,57.15 10.16,50.16 1.27,6.35 1.27,3.81 20.95,46.35 16.51,48.89 13.97,49.15 19.05,48.89 48.26,1.27 20.32,44.7 29.84,44.58 7.62,43.18 7.49,33.91 41.91,40.51 26.16,32.89 0.76,35.18 34.29,31.75 10.92,54.23 10.16,29.21
  pour Top (isolate 0.305, rank 2): 0,2.54 0,55.88 1.27,57.15 12.7,57.15 15.24,59.69 48.26,59.69 50.8,57.15 53.34,57.15 53.34,2.54 50.8,0 2.54,0
  pour Bottom (isolate 0.305, rank 2): 0,2.54 0,55.88 1.27,57.15 12.7,57.15 15.24,59.69 48.26,59.69 50.8,57.15 53.34,57.15 53.34,2.54 50.8,0 2.54,0
GPIN0
  Top 0.203: J2.1 7.62,19.05 9.91,21.34 22.61,21.34 26.92,25.65 26.92,36.58 29.7,39.35 U5.26
GPIN1
  Top 0.203: J2.2 10.16,19.05 12.06,20.95 22.86,20.95 27.43,25.53 27.43,36.45 29.83,38.85 U5.27
GPIN2
  Top 0.203: J2.3 12.7,19.05 14.22,20.57 23.11,20.57 27.94,25.4 27.94,36.32 29.97,38.35 U5.28
GPIN3
  Top 0.203: J2.4 15.24,19.05 16.38,20.19 23.37,20.19 28.45,25.27 28.45,36.07 30.23,37.85 U5.29
GPIN4
  Top 0.203: J2.5 17.78,18.92 18.67,19.81 23.62,19.81 28.96,25.15 28.96,35.94 30.36,37.35 U5.30
GPIN5
  Top 0.203: J2.6 21.97,19.43 23.88,19.43 29.46,25.02 29.46,35.81 30.5,36.85 U5.31
GPIN6
  Top 0.203: J2.7 29.97,24.89 29.97,35.56 30.76,36.35 U5.32
GPIN7
  Top 0.203: J2.8 30.48,22.86 30.48,34.29 31.11,34.92 U5.1
GPOUT0
  Top 0.203: J3.1 35.31,25.15 U5.4
GPOUT1
  Top 0.203: J3.2 35.81,23.11 U5.5
GPOUT2
  Top 0.203: J3.3 36.31,21.07 U5.6
GPOUT3
  Top 0.203: J3.4 36.81,19.03 U5.7
GPOUT4
  Top 0.203: J3.5 38.1,19.18 37.31,19.97 U5.8
GPOUT5
  Top 0.203: J3.6 37.85,20.57 37.85,33.15 38.74,34.04 U5.9
GPOUT6
  Top 0.203: J3.7 43.18,19.3 42.67,19.81 39.75,19.81 38.35,21.21 38.35,32.38 40.26,34.29 40.26,36.58 39.98,36.85 U5.10
GPOUT7
  Top 0.203: J3.8 45.72,19.18 44.45,20.45 40.64,20.45 38.99,22.1 38.99,31.5 40.77,33.27 40.77,36.7 40.12,37.35 U5.11
GPX  (via drill 0.38)
  Top 0.203: v38.73,40.51 37.97,41.28 U5.17
  Bottom 0.203: U1.D8 5.08,33.02 5.84,33.78 5.84,35.43 8.76,38.35 9.65,38.35 10.16,38.86 10.16,41.78 11.18,42.8 17.65,42.8 19.94,40.51 v38.73,40.51
INT  (via drill 0.38)
  Top 0.203: R6.1 38.73,45.05 v38.73,43.81 37.97,43.05 37.45,43.05 36.81,42.42 U5.18
  Bottom 0.203: U1.D9 1.27,31.75 1.27,34.29 1.65,34.67 4.45,34.67 8.85,39.08 8.85,42.63 10.29,44.07 20.07,44.07 21.34,42.8 37.72,42.8 v38.73,43.81
MAX_D_N
  Top 0.127: R2.2 36.32,48.05 36.32,43.56 35.81,43.05 U5.20
MAX_D_P
  Top 0.127: R3.2 36.07,47.92 36.07,43.69 35.56,43.18 35.56,43.16 35.56,43.15 35.56,42.41 35.31,42.16 U5.21
N$1
  Top 0.203: S2.3 46.74,23.88 46.99,24.13 U1.RES
N$2
  Top 0.508: S5.2 S5.5 S4.5 S4.2
N$3  (via drill 1.02 pad 1.88)
  other vias: 7.62,2.54
N$4
  Top 0.508: U2.1 19.48,39.17 19.68,39.37 R8.1 20.69,39.42 C11.1 20.69,43.13 R7.2
N$5
  Top 0.508: S5.1 S5.4
N$6  (via drill 0.38)
  Top 0.508: 16.18,39.17 U2.2 | C2.1 21.59,38.31 v21.59,38.48 21.59,38.52 R8.2 | S4.3 12.74,40.93
  other vias: 16.51,35.56 17.78,33.78 12.06,33.66 12.57,32.38 13.97,35.56 12.7,36.83 19.05,36.83 17.78,36.83 15.24,36.83 21.21,36.32 19.05,38.1 16.38,40.89 13.97,41.4 18.92,40.26 17.65,32.26 11.68,40.89 11.56,38.23
  pour Bottom (isolate 0.305): 19.56,40.13 17.4,42.29 11.43,42.29 10.79,41.66 10.79,38.73 8.13,36.07 8.13,32 17.91,32 17.91,32.89 19.81,34.8 21.21,34.8 23.37,36.96 23.37,39.75 22.99,40.13
  pour Top (isolate 0.305): 11.3,48.26 14.22,48.26 14.22,41.27 18.54,41.27 19.68,40.13 19.68,38.86 20.32,38.23 21.21,38.23 21.59,37.85 21.59,34.16 21.08,33.66 20.32,33.66 18.54,31.88 11.81,31.88 11.3,32.38
N$7
  Top 0.203: D1.A 24.48,48.88 R1.1
N$8
  Top 0.254: J1.SHLD3 J1.SHLD4 J1.SHLD2 | J1.SHLD3 J1.SHLD1 | SHLD.2 41.39,58.04 41.01,58.42 39.77,58.42 J1.SHLD3
N$32  (via drill 1.02 pad 1.88)
  other vias: 7.62,15.24
N$33  (via drill 1.02 pad 1.88)
  other vias: 10.16,15.24
N$35  (via drill 1.02 pad 1.88)
  other vias: 12.7,15.24
N$38  (via drill 1.02 pad 1.88)
  other vias: 15.24,15.24
N$39  (via drill 1.02 pad 1.88)
  other vias: 17.78,15.24
N$40  (via drill 1.02 pad 1.88)
  other vias: 20.32,15.24
N$41  (via drill 1.02 pad 1.88)
  other vias: 22.86,15.24
N$42  (via drill 1.02 pad 1.88)
  other vias: 25.4,15.24
N$43  (via drill 1.02 pad 1.88)
  other vias: 27.94,15.24
N$44  (via drill 1.02 pad 1.88)
  other vias: 30.48,15.24
N$45  (via drill 1.02 pad 1.88)
  other vias: 33.02,15.24
N$46  (via drill 1.02 pad 1.88)
  other vias: 35.56,15.24
N$47  (via drill 1.02 pad 1.88)
  other vias: 38.1,15.24
N$48  (via drill 1.02 pad 1.88)
  other vias: 40.64,15.24
N$49  (via drill 1.02 pad 1.88)
  other vias: 43.18,15.24
N$50  (via drill 1.02 pad 1.88)
  other vias: 45.72,15.24
N$51  (via drill 1.02 pad 1.88)
  other vias: 7.62,12.7
N$52  (via drill 1.02 pad 1.88)
  other vias: 10.16,12.7
N$53  (via drill 1.02 pad 1.88)
  other vias: 12.7,12.7
N$54  (via drill 1.02 pad 1.88)
  other vias: 15.24,12.7
N$55  (via drill 1.02 pad 1.88)
  other vias: 17.78,12.7
N$56  (via drill 1.02 pad 1.88)
  other vias: 20.32,12.7
N$57  (via drill 1.02 pad 1.88)
  other vias: 22.86,12.7
N$58  (via drill 1.02 pad 1.88)
  other vias: 25.4,12.7
N$59  (via drill 1.02 pad 1.88)
  other vias: 27.94,12.7
N$60  (via drill 1.02 pad 1.88)
  other vias: 30.48,12.7
N$61  (via drill 1.02 pad 1.88)
  other vias: 33.02,12.7
N$62  (via drill 1.02 pad 1.88)
  other vias: 35.56,12.7
N$63  (via drill 1.02 pad 1.88)
  other vias: 38.1,12.7
N$64  (via drill 1.02 pad 1.88)
  other vias: 40.64,12.7
N$65  (via drill 1.02 pad 1.88)
  other vias: 43.18,12.7
N$66  (via drill 1.02 pad 1.88)
  other vias: 45.72,12.7
N$67  (via drill 1.02 pad 1.88)
  other vias: 7.62,10.16
N$68  (via drill 1.02 pad 1.88)
  other vias: 10.16,10.16
N$69  (via drill 1.02 pad 1.88)
  other vias: 12.7,10.16
N$70  (via drill 1.02 pad 1.88)
  other vias: 15.24,10.16
N$71  (via drill 1.02 pad 1.88)
  other vias: 17.78,10.16
N$72  (via drill 1.02 pad 1.88)
  other vias: 20.32,10.16
N$73  (via drill 1.02 pad 1.88)
  other vias: 22.86,10.16
N$74  (via drill 1.02 pad 1.88)
  other vias: 25.4,10.16
N$75  (via drill 1.02 pad 1.88)
  other vias: 27.94,10.16
N$76  (via drill 1.02 pad 1.88)
  other vias: 30.48,10.16
N$77  (via drill 1.02 pad 1.88)
  other vias: 33.02,10.16
N$78  (via drill 1.02 pad 1.88)
  other vias: 35.56,10.16
N$79  (via drill 1.02 pad 1.88)
  other vias: 38.1,10.16
N$80  (via drill 1.02 pad 1.88)
  other vias: 40.64,10.16
N$81  (via drill 1.02 pad 1.88)
  other vias: 43.18,10.16
N$82  (via drill 1.02 pad 1.88)
  other vias: 45.72,10.16
N$83  (via drill 1.02 pad 1.88)
  other vias: 7.62,7.62
N$84  (via drill 1.02 pad 1.88)
  other vias: 10.16,7.62
N$85  (via drill 1.02 pad 1.88)
  other vias: 12.7,7.62
N$86  (via drill 1.02 pad 1.88)
  other vias: 15.24,7.62
N$87  (via drill 1.02 pad 1.88)
  other vias: 17.78,7.62
N$88  (via drill 1.02 pad 1.88)
  other vias: 20.32,7.62
N$89  (via drill 1.02 pad 1.88)
  other vias: 22.86,7.62
N$90  (via drill 1.02 pad 1.88)
  other vias: 25.4,7.62
N$91  (via drill 1.02 pad 1.88)
  other vias: 27.94,7.62
N$92  (via drill 1.02 pad 1.88)
  other vias: 30.48,7.62
N$93  (via drill 1.02 pad 1.88)
  other vias: 33.02,7.62
N$94  (via drill 1.02 pad 1.88)
  other vias: 35.56,7.62
N$95  (via drill 1.02 pad 1.88)
  other vias: 38.1,7.62
N$96  (via drill 1.02 pad 1.88)
  other vias: 40.64,7.62
N$97  (via drill 1.02 pad 1.88)
  other vias: 43.18,7.62
N$98  (via drill 1.02 pad 1.88)
  other vias: 45.72,7.62
N$99  (via drill 1.02 pad 1.88)
  other vias: 7.62,5.08
N$100  (via drill 1.02 pad 1.88)
  other vias: 10.16,5.08
N$101  (via drill 1.02 pad 1.88)
  other vias: 12.7,5.08
N$102  (via drill 1.02 pad 1.88)
  other vias: 15.24,5.08
N$103  (via drill 1.02 pad 1.88)
  other vias: 17.78,5.08
N$104  (via drill 1.02 pad 1.88)
  other vias: 20.32,5.08
N$105  (via drill 1.02 pad 1.88)
  other vias: 22.86,5.08
N$106  (via drill 1.02 pad 1.88)
  other vias: 25.4,5.08
N$107  (via drill 1.02 pad 1.88)
  other vias: 27.94,5.08
N$108  (via drill 1.02 pad 1.88)
  other vias: 30.48,5.08
N$109  (via drill 1.02 pad 1.88)
  other vias: 33.02,5.08
N$110  (via drill 1.02 pad 1.88)
  other vias: 35.56,5.08
N$111  (via drill 1.02 pad 1.88)
  other vias: 38.1,5.08
N$112  (via drill 1.02 pad 1.88)
  other vias: 40.64,5.08
N$113  (via drill 1.02 pad 1.88)
  other vias: 43.18,5.08
N$114  (via drill 1.02 pad 1.88)
  other vias: 45.72,5.08
N$115  (via drill 1.02 pad 1.88)
  other vias: 10.16,2.54
N$116  (via drill 1.02 pad 1.88)
  other vias: 12.7,2.54
N$117  (via drill 1.02 pad 1.88)
  other vias: 15.24,2.54
N$118  (via drill 1.02 pad 1.88)
  other vias: 17.78,2.54
N$119  (via drill 1.02 pad 1.88)
  other vias: 20.32,2.54
N$120  (via drill 1.02 pad 1.88)
  other vias: 22.86,2.54
N$121  (via drill 1.02 pad 1.88)
  other vias: 25.4,2.54
N$122  (via drill 1.02 pad 1.88)
  other vias: 27.94,2.54
N$123  (via drill 1.02 pad 1.88)
  other vias: 30.48,2.54
N$124  (via drill 1.02 pad 1.88)
  other vias: 33.02,2.54
N$125  (via drill 1.02 pad 1.88)
  other vias: 35.56,2.54
N$126  (via drill 1.02 pad 1.88)
  other vias: 38.1,2.54
N$127  (via drill 1.02 pad 1.88)
  other vias: 40.64,2.54
N$128  (via drill 1.02 pad 1.88)
  other vias: 43.18,2.54
N$129  (via drill 1.02 pad 1.88)
  other vias: 45.72,2.54
PICO
  Top 0.203: U3.7 19.68,25.91 19.43,26.16 5.59,26.16 4.83,25.4 U1.D11
PICO-IN  (via drill 0.38)
  Top 0.203: U3.6 v18.41,23.49 | v41.4,37.63 41.44,37.63 42.16,38.35 42.16,39.5 41.81,39.85 U5.16
  Bottom 0.203: v18.41,23.49 18.41,26.29 27.94,35.81 39.62,35.81 41.4,37.59 v41.4,37.63
POCI  (via drill 0.38)
  Top 0.203: v41.62,39.27 41.54,39.35 U5.15
  Bottom 0.203: U1.D12 3.81,22.86 4.32,23.37 11.43,23.37 13.97,25.91 15.88,25.91 27.3,37.34 38.23,37.34 40.16,39.27 v41.62,39.27
RESET
  Top 0.203: U3.9 20.95,31.88 20.57,32.26 19.94,32.26 19.18,31.5 11.3,31.5 | 11.3,31.5 11.3,30.48 10.79,29.97 6.99,29.97 5.84,31.11 5.84,33.53 U1.D7 | 11.3,31.5 11.05,31.75 R4.1
RESET-IN  (via drill 0.38)
  Top 0.203: v42.16,37.08 40.85,37.08 40.09,37.85 U5.12 | U3.10 19.68,31.37 19.94,31.62 v20.32,31.62
  Bottom 0.203: v20.32,31.62 20.83,31.62 27.05,37.85 37.97,37.85 39.94,39.82 41.84,39.82 42.16,39.5 v42.16,37.08
SCK
  Top 0.203: U3.3 14.61,22.86 14.22,22.48 9.4,22.48 7.24,20.32 U1.D13
SCK-IN  (via drill 0.38)
  Top 0.203: U3.2 v13.34,23.49 | v40.14,38.4 40.09,38.35 U5.13
  Bottom 0.203: v40.14,38.4 38.57,36.83 27.56,36.83 16.13,25.4 14.35,25.4 13.34,24.38 v13.34,23.49
VBCOMP
  Top 0.203: C3.1 34.92,42.93 34.81,42.81 U5.22
VBUS  (via drill 0.38)
  Top 0.508: F1.1 31.25,51.69 31.62,52.07 32.44,52.07 32.98,52.62 | J1.VBUS2 32.98,52.62 | 32.98,52.62 v33.02,52.58 | v37.85,52.58 37.85,53.64 J1.VBUS1
  Bottom 0.508: v33.02,52.58 v37.85,52.58
VDD  (via drill 0.38)
  Top 0.508: R9.2 v39.37,48.26 | R10.2 v33.66,48.26 33.53,48.13 29.08,48.13 28.45,48.77 F1.2 27.05,50.04 26.41,50.67 21.21,50.67 20.42,49.88 S5.6 S5.3 16.75,56.52 11.05,56.52 8.57,54.04 8.57,42.29 | U6.3 6.67,41.85 7.11,42.29 8.57,42.29 | 8.57,42.29 U6.1
  Bottom 0.508: v33.66,48.26 v39.37,48.26
VIN  (via drill 0.38)
  Top 0.508: C1.1 10.29,33.44 C6.+ 10.29,37.21 9.53,37.98 v9.53,39.12 9.58,39.17 U2.3
  Bottom 0.508: U1.VIN 49.78,37.85 47.75,37.85 44.32,41.27 20.32,41.27 18.16,43.43 10.67,43.43 9.53,42.29 v9.53,39.12
XI
  Top 0.203: 29.21,42.67 33.53,42.67 33.81,42.39 U5.24 | 29.21,42.67 27.58,42.67 Y1.P3 | C10.1 28.7,44.2 29.21,43.69 29.21,42.67
XO
  Top 0.203: Y1.P1 25.78,41.18 25.78,40.51 26.04,40.26 27.52,40.26 | 27.52,40.26 29.72,40.26 30.13,39.85 U5.25 | C9.1 27.52,40.26

### Text on the board
Bottom: V10
tDocu: A. Weiss | M. Chodikov